# Altium schematic sheet Sheet1.SchDoc
size A; SheetNumber: 1; SheetTotal: 1
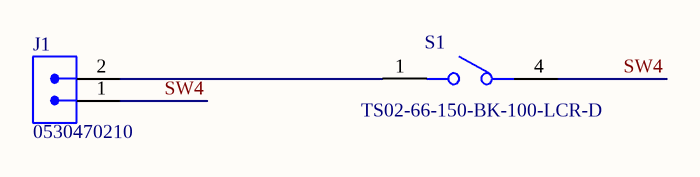
[diagram p0: Sheet1.SchDoc]

## Parts
J1  0530470210  [2POS]
S1  TS02-66-150-BK-100-LCR-D  [6mm x 6mm]

## Nets
SW4: J1.1 S1.4
NetJ1_2: J1.2 S1.1

## Library data of the parts
J1 = 0530470210: Connector Header Through Hole 2 position 0.049" (1.25mm)
S1 = TS02-66-150-BK-100-LCR-D: Tactile Switch SPST-NO Top Actuated Through Hole; pin to pad: 1>1+2 4>4+3